# Altium project LM25148.PrjPcb
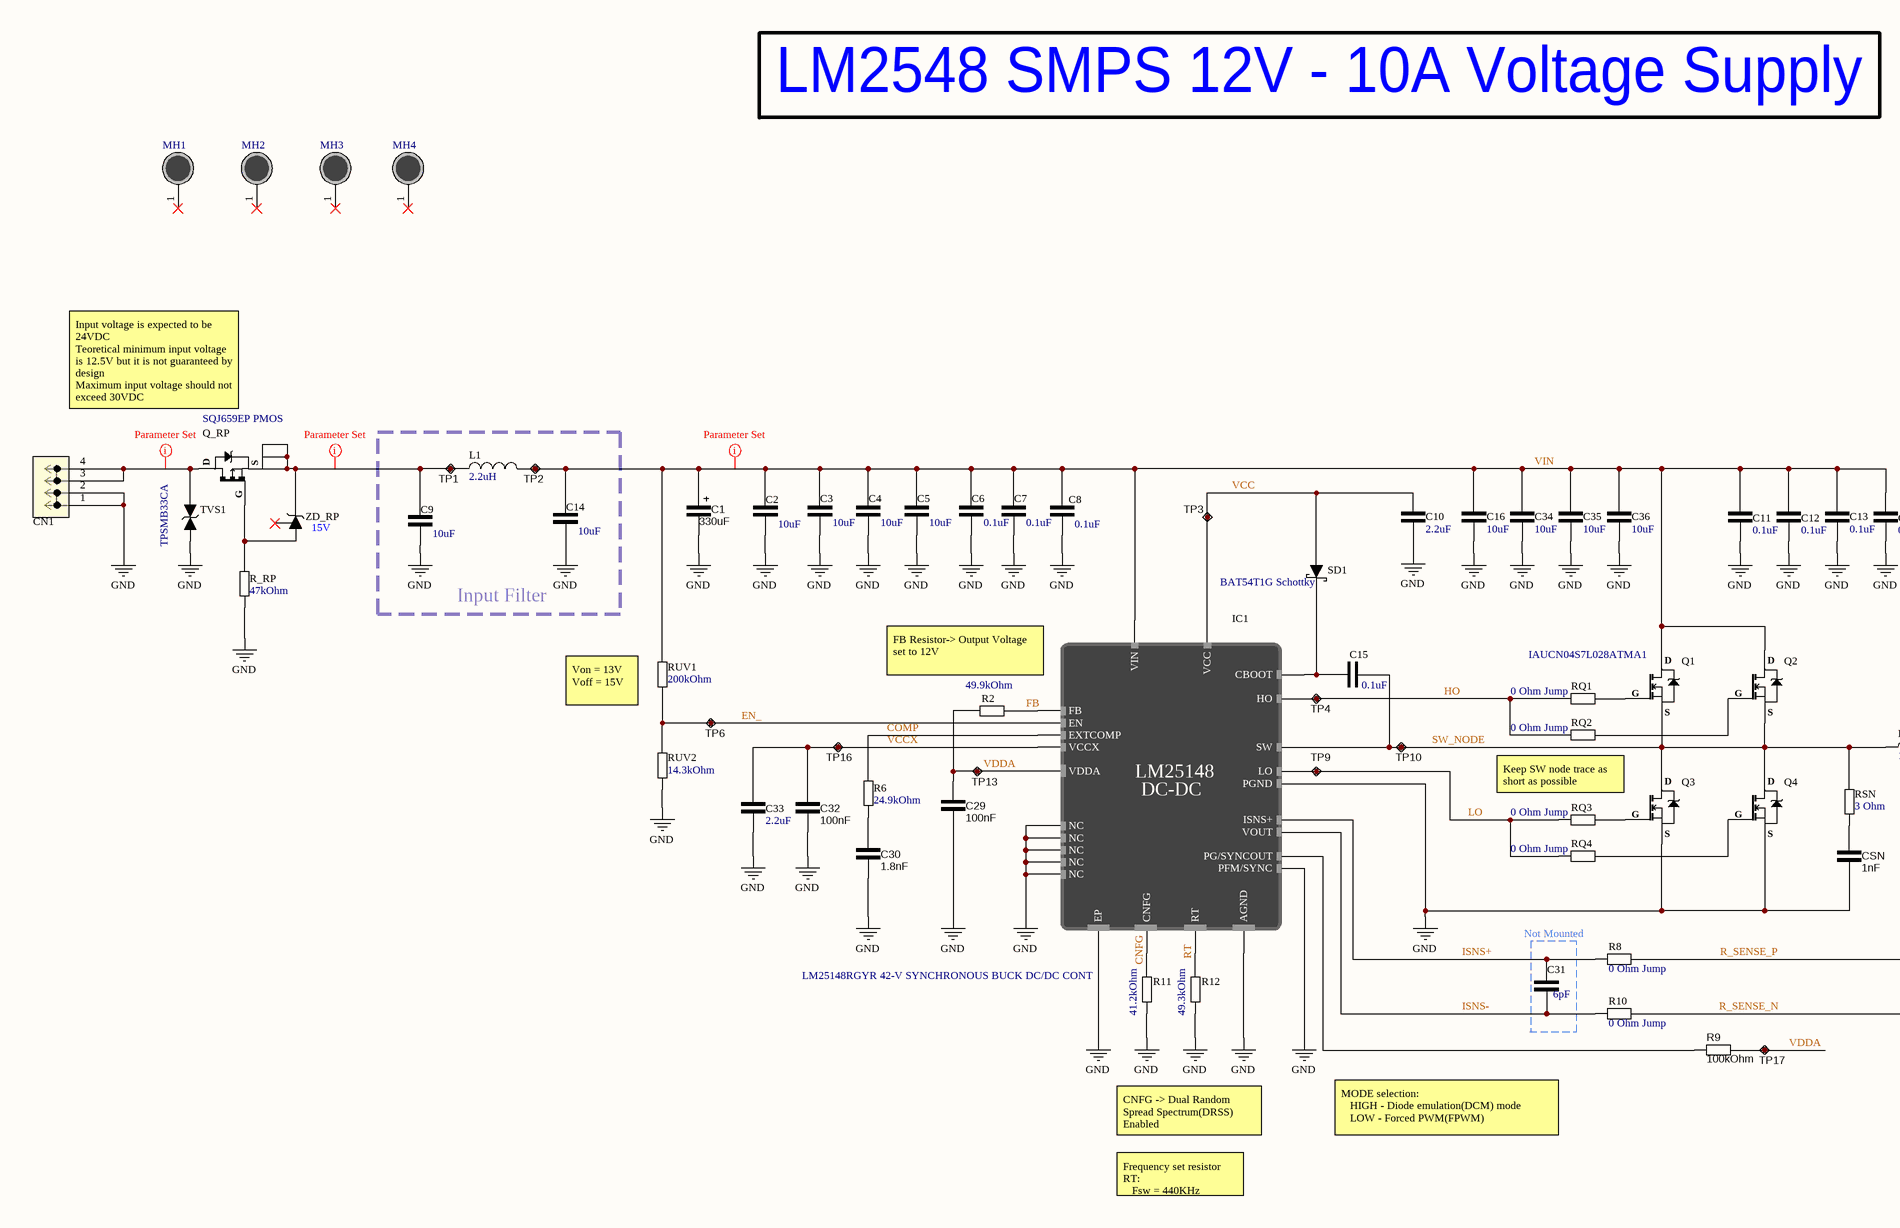
[diagram p0: LM25148_eval_BRD.SchDoc, left]
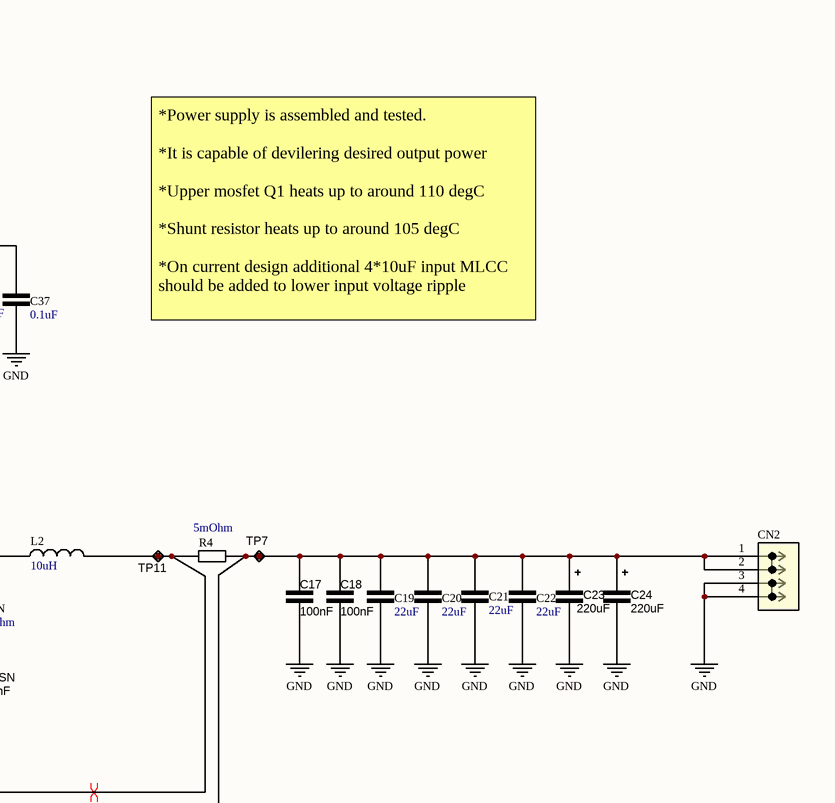
[diagram p1: LM25148_eval_BRD.SchDoc, right]
1 sheet, 79 parts. Net scope: global (net labels, ports and power ports of the same name join across sheets).
Board file: LM25148.PcbDoc

## Sheet LM25148_eval_BRD.SchDoc
size A2; SheetNumber: 1; SheetTotal: 1

### Parts
C1  330uF  [CAPAE109103X103M]
C2  10uF  [CAP_1206]
C3  10uF  [CAP_1206]
C4  10uF  [CAP_1206]
C5  10uF  [CAP_1206]
C6  0.1uF  [CAP_0603]
C7  0.1uF  [CAP_0603]
C8  0.1uF  [CAP_0603]
C9  10uF  [CAP_1206]
C10  2.2uF  [CAP_0603]
C11  0.1uF  [CAP_0603]
C12  0.1uF  [CAP_0603]
C13  0.1uF  [CAP_0603]
C14  10uF  [CAP_1206]
C15  0.1uF  [CAP_0603]
C16  10uF  [CAP_1206]
C17  100nF  [CAP_0603]
C18  100nF  [CAP_0603]
C19  22uF  [CAP_1210]
C20  22uF  [CAP_1210]
C21  22uF  [CAP_1210]
C22  22uF  [CAP_1210]
C23  220uF  [CAPAE109103X103M]
C24  220uF  [CAPAE109103X103M]
C29  100nF  [CAP_0603]
C30  1.8nF  [CAP_0603]
C31  6pF  [CAP_0402]
C32  100nF  [CAP_0603]
C33  2.2uF  [CAP_0603]
C34  10uF  [CAP_1206]
C35  10uF  [CAP_1206]
C36  10uF  [CAP_1206]
C37  0.1uF  [CAP_0603]
CN1  TERM BLK PCB LEVER 3.5MM 2POS  [CONN2_2601-1102_WAG]  (value not drawn)
CN2  TERM BLK PCB LEVER 3.5MM 2POS  [CONN2_2601-1102_WAG]  (value not drawn)
CSN  1nF  [CAP_0805]
IC1  LM25148RGYR 42-V SYNCHRONOUS BUCK DC/DC CONT  [VQFN25_RGY_TEX]
L1  2.2uH  [IHLP-3232DZ-51]
L2  10uH  [INDP135126X65N]
MH1  Mounting Hole  [HOLE-3mm]  (value not drawn)  (no BOM)
MH2  Mounting Hole  [HOLE-3mm]  (value not drawn)  (no BOM)
MH3  Mounting Hole  [HOLE-3mm]  (value not drawn)  (no BOM)
MH4  Mounting Hole  [HOLE-3mm]  (value not drawn)  (no BOM)
Q1  IAUCN04S7L028ATMA1  [PG-TDSON-8-33]
Q2  IAUCN04S7L028ATMA1  [PG-TDSON-8-33]  (value not drawn)
Q3  IAUCN04S7L028ATMA1  [PG-TDSON-8-33]  (value not drawn)
Q4  IAUCN04S7L028ATMA1  [PG-TDSON-8-33]  (value not drawn)
Q_RP  SQJ659EP PMOS  [PowerPAK SO-8L SINGLE]
R2  49.9kOhm  [RES_0603]
R4  5mOhm  [SENSE_RES_2512]
R6  24.9kOhm  [RES_0603]
R8  0 Ohm Jump  [RES_0402]
R9  100kOhm  [RES_0603]
R10  0 Ohm Jump  [RES_0402]
R11  41.2kOhm  [RES_0603]
R12  49.3kOhm  [RES_0603]
R_RP  47kOhm  [RES_0603]
RQ1  0 Ohm Jump  [RES_0402]
RQ2  0 Ohm Jump  [RES_0402]
RQ3  0 Ohm Jump  [RES_0402]
RQ4  0 Ohm Jump  [RES_0402]
RSN  3 Ohm  [RES_0805]
RUV1  200kOhm  [RES_0603]
RUV2  14.3kOhm  [RES_0603]
SD1  BAT54T1G Schottky  [SODFL371X135-2N]
TP1  Test point  [TestPoint]  (value not drawn)  (no BOM)
TP2  Test point  [TestPoint]  (value not drawn)  (no BOM)
TP3  Test point  [TestPoint]  (value not drawn)  (no BOM)
TP4  Test point  [TestPoint]  (value not drawn)  (no BOM)
TP6  Test point  [TestPoint]  (value not drawn)  (no BOM)
TP7  Test point  [TestPoint]  (value not drawn)  (no BOM)
TP9  Test point  [TestPoint]  (value not drawn)  (no BOM)
TP10  Test point  [TestPoint]  (value not drawn)  (no BOM)
TP11  Test point  [TestPoint]  (value not drawn)  (no BOM)
TP13  Test point  [TestPoint]  (value not drawn)  (no BOM)
TP16  Test point  [TestPoint]  (value not drawn)  (no BOM)
TP17  Test point  [TestPoint]  (value not drawn)  (no BOM)
TVS1  TPSMB33CA  [DO-214AA]
ZD_RP  DZ23C15-E3-08 Zener Diode  [SOT95P245X96-3N]  (value not drawn)

### Blocks framed on the sheet
Input Filter: C9 C14 L1 TP1 TP2

### Nets
GND: C1.2 C2.1 C3.2 C4.2 C5.2 C6.2 C7.2 C8.1 C9.1 C10.1 C11.1 C12.1 C13.2 C14.1 C16.2 C17.1 C18.1 C19.2 C20.2 C21.1 C22.2 C23.2 C24.2 C29.1 C30.1 C32.1 C33.2 C34.2 C35.2 C36.2 C37.1 CN1.1(1_1) CN1.2(1_2) CN2.3(2_1) CN2.4(2_2) CSN.1 IC1.1(NC) IC1.2(NC) IC1.7(AGND) IC1.10(PGND) IC1.18(PFM/SYNC) IC1.22(NC) IC1.23(NC) IC1.24(NC) IC1.25(EP) Q3.S(Source) Q4.S(Source) R11.1 R12.1 R_RP.1 RUV2.1 TVS1.2(Anode)
CNFG: IC1.3(CNFG) R11.2
COMP: IC1.5(EXTCOMP) R6.2
EN_: IC1.19(EN) RUV1.1 RUV2.2 TP6.1
FB: IC1.6(FB) R2.2
HO: IC1.13(HO) RQ1.1 RQ2.1 TP4.1
ISNS+: C31.2 IC1.20(ISNS+) R8.1
ISNS-: C31.1 IC1.21(VOUT) R10.1
LO: IC1.11(LO) RQ3.1 RQ4.1 TP9.1
R_SENSE_N: C17.2 C18.2 C19.1 C20.1 C21.2 C22.1 C23.1 C24.1 CN2.1(1_1) CN2.2(1_2) R4.2 R10.2 TP7.1
R_SENSE_P: L2.2 R4.1 R8.2 TP11.1
RT: IC1.4(RT) R12.2
SW_NODE: C15.1 IC1.14(SW) L2.1 Q1.S(Source) Q2.S(Source) Q3.D(Drain) Q4.D(Drain) RSN.2 TP10.1
VCC: C10.2 IC1.9(VCC) SD1.1(Anode) TP3.1
VCCX: C32.2 C33.1 IC1.16(VCCX) TP16.1
VDDA: C29.2 IC1.8(VDDA) R2.1 R9.2 TP13.1 TP17.1
VIN: C1.1 C2.2 C3.1 C4.1 C5.1 C6.1 C7.1 C8.2 C11.2 C12.2 C13.1 C14.2 C16.1 C34.1 C35.1 C36.1 C37.2 IC1.12(VIN) L1.2 Q1.D(Drain) Q2.D(Drain) RUV1.2 TP2.1
NetC9_2: C9.2 L1.1 Q_RP.S(S1) TP1.1 ZD_RP.3(Cathode)
NetC15_2: C15.2 IC1.15(CBOOT) SD1.2(Cathode)
NetC30_2: C30.2 R6.1
NetCN1_3: CN1.3(2_1) CN1.4(2_2) Q_RP.D TVS1.1(Cathode)
NetCSN_2: CSN.2 RSN.1
NetIC1_17: IC1.17(PG/SYNCOUT) R9.1
NetQ1_G: Q1.G(Gate) RQ1.2
NetQ2_G: Q2.G(Gate) RQ2.2
NetQ3_G: Q3.G(Gate) RQ3.2
NetQ4_G: Q4.G(Gate) RQ4.2
NetQ_RP_G: Q_RP.G R_RP.2 ZD_RP.1(Anode)

Not connected (* = marked no-connect by the designer): MH1 1*; MH2 1*; MH3 1*; MH4 1*; ZD_RP 2(Anode)*

### Layout directives
differential pair: R_SENSE_N, R_SENSE_P
rule Clearance Constraint [Clearance = 20mil]: NetC9_2, NetCN1_3
rule Clearance Constraint [Generic clearance = 20mil, and 1 value(s) for objects]: VIN

### Notes on the sheet
- LM2548 SMPS 12V - 10A Voltage Supply
- (near Q_RP) Input voltage is expected to be 24VDC
  Teoretical minimum input voltage is 12.5V but it is not guaranteed by design
  Maximum input voltage should not exceed 30VDC
- (near ZD_RP) 15V
- *Power supply is assembled and tested.
  *It is capable of devilering desired output power
  *Upper mosfet Q1 heats up to around 110 degC
  *Shunt resistor heats up to around 105 degC
  *On current design additional 4*10uF input MLCC should be added to lower input voltage ripple
- (near IC1) FB Resistor-> Output Voltage set to 12V
- (near RUV1) Von = 13V
  Voff = 15V
- Keep SW node trace as short as possible
- Not Mounted
- CNFG -> Dual Random Spread Spectrum(DRSS) Enabled
- MODE selection:
  HIGH - Diode emulation(DCM) mode
  LOW - Forced PWM(FPWM)
- Frequency set resistor RT:
  Fsw = 440KHz
- (in symbol LM25148RGYR) LM25148; DC-DC

### Library data of the parts
C1 = C000026: 330 µF 50 V Aluminum Electrolytic Capacitors Radial, Can - SMD 120mOhm @ 100kHz 2000 Hrs @ 105°C; Manufacturer Product Number: EMZR500ARA331MJA0G; capacitance: 330uF; ComponentLink1Description: DigiKey; ComponentLink1URL: https://www.digikey.com/en/products/detail/chemi-con/EMZR500ARA331MJA0G/5824768; DigiKey Part Number: 565-EMZR500ARA331MJA0GCT-ND
C2-C5 C9 C14 C16 C34-C36 = C000017: 10 µF ±10% 50V Ceramic Capacitor X7R 1206 (3216 Metric); Manufacturer Product Number: CL31B106KBHNNNE; capacitance: 10uF; ComponentLink1Description: DigiKey; ComponentLink1URL: https://www.digikey.com/en/products/detail/samsung-electro-mechanics/CL31B106KBHNNNE/5961251; DigiKey Part Number: 1276-6767-1-ND
C6-C8 C11-C13 C15 C37 = C000018: 0.1 µF ±10% 50V Ceramic Capacitor X7R 0603 (1608 Metric); Manufacturer Product Number: CL10B104KB8NNNC; capacitance: 0.1uF; ComponentLink1Description: DigiKey; ComponentLink1URL: https://www.digikey.com/en/products/detail/samsung-electro-mechanics/CL10B104KB8NNNC/3886658; DigiKey Part Number: 1276-1000-1-ND
C10 C33 = C000014: 8 pF ±0.05pF 25V Ceramic Capacitor C0G, NP0 01005 (0402 Metric); Manufacturer Product Number: GRM188C71C225KE11D; ComponentLink1Description: DigiKey; ComponentLink1URL: https://www.digikey.com/en/products/detail/murata-electronics/GRM188C71C225KE11D/4905311; DigiKey Part Number: 490-12731-1-ND; capacitance: 2.2uF
C17 C18 C29 C32 = C000007: 0.1 µF ±10% 25V Ceramic Capacitor X7R 0603 (1608 Metric); Manufacturer Product Number: KAM15AR71E104KT; ComponentLink1Description: DigiKey; ComponentLink1URL: https://www.digikey.com/en/products/detail/kyocera-avx/06033C104K4T2A/8019250; capacitance: 100nF; DigiKey Part Number: 478-KAM15AR71E104KTCT-ND
C19-C22 = C000032: 22 µF ±10% 25V Ceramic Capacitor X7R 1210 (3225 Metric); Manufacturer Product Number: CL32B226KAJNNNE; DigiKey Part Number: 1276-3392-1-ND; ComponentLink1Description: DigiKey; ComponentLink1URL: https://www.digikey.com/en/products/detail/samsung-electro-mechanics/CL32B226KAJNNNE/3889050; capacitance: 22uF
C23 C24 = C000033: 220 µF 35 V Aluminum - Polymer Capacitors Radial, Can - SMD 23mOhm 1000 Hrs @ 150°C; Manufacturer Product Number: A785MN227M1VLAS023; capacitance: 220uF; ComponentLink1Description: DigiKey; ComponentLink1URL: https://www.digikey.com/en/products/detail/kemet/A785MN227M1VLAS023/22003773?s=N4IgTCBcDaIIIHYAcBWAsgOTGBaCMAagDJwDKADGAMwgC6AvkA; DigiKey Part Number: 399-A785MN227M1VLAS023CT-ND
C30 = C000027: 1800 pF ±10% 25V Ceramic Capacitor X7R 0603 (1608 Metric); Manufacturer Product Number: C0603C182K3RACTU; ComponentLink1Description: DigiKey; ComponentLink1URL: https://www.digikey.com/en/products/detail/kemet/C0603C182K3RAC7867/2200107; DigiKey Part Number: 399-15370-1-ND; capacitance: 1.8nF
C31 = C000016: 6 pF ±0.5pF 25V Ceramic Capacitor C0G, NP0 0402 (1005 Metric); Manufacturer Product Number: CBR04C609D3GAC; DigiKey Part Number: 399-CBR04C609D3GACCT-ND; ComponentLink1Description: DigiKey; ComponentLink1URL: https://www.digikey.com/en/products/detail/kemet/CBR04C609D3GAC/18137865?s=N4IgjCBcpgLFoDGUBmBDANgZwKYBoQB7KAbXAFYBOAJlgHYQBdAgBwBcoQBlNgJwEsAdgHMQAXwJgAbAhDJI6bPiKkQAZkphyADiasOkbnyGiJIagAZYlWfMW4CxSGSkACFgDE9IdpwCqgvxsAPIoALI4aFgArrw44gQAtNS2UHzRyk5k5ExieUA; capacitance: 6pF
CN1 CN2 = 00000017: 2 Position Wire to Board Terminal Block Horizontal with Board 0.138" (3.50mm) Through Hole; Manufacturer Product Number: 2601-1102; Digikey Part Number: 2946-2601-1102-ND; ComponentLink1Description: Digikey; ComponentLink1URL: https://www.digikey.com/en/products/detail/wago-corporation/2601-1102/17122694
CSN = C000035: 1000 pF ±10% 100V Ceramic Capacitor X7R 0805 (2012 Metric); Manufacturer Product Number: CC0805KRX7R0BB102; capacitance: 1nF; ComponentLink1Description: DigiKey; ComponentLink1URL: https://www.digikey.com/en/products/detail/yageo/CC0805KRX7R0BB102/2833637; DigiKey Part Number: 311-1472-1-ND
IC1 = LM25148RGYR: Buck Regulator Positive Output Step-Down DC-DC Controller IC 24-VQFN (5.5x3.5); DigiKey Part Number: 296-LM25148RGYRCT-ND; Mouser Part Number: 595-LM25148RGYR; ComponentLink1Description: DigiKey; ComponentLink1URL: https://www.digikey.com/en/products/detail/texas-instruments/LM25148RGYR/15857124; ComponentLink2Description: Mouser; ComponentLink2URL: https://eu.mouser.com/ProductDetail/Texas-Instruments/LM25148RGYR?qs=doiCPypUmgEViljGB5jAZw%3D%3D; Manufacturer Product Number: LM25148RGYR
L1 = L000015: FIXED IND 2.2UH 11.5A 12.5 MOHM; Manufacturer Product Number: IHLP3232DZER2R2M5A; inductance: 2.2uH; DigiKey Part Number: 541-IHLP3232DZER2R2M5ACT-ND; ComponentLink1Description: DigiKey; ComponentLink1URL: https://www.digikey.com/en/products/detail/vishay-dale/IHLP3232DZER2R2M5A/4070222; case: 3232; Mouser Part Number: 70-IHLP3232DZR2R2M5A; ComponentLink2Description: Mouser; ComponentLink2URL: https://eu.mouser.com/ProductDetail/Vishay-Dale/IHLP3232DZER2R2M5A?qs=tDDpbAIEejr3%252BeiaEh99%252Bg%3D%3D
L2 = L000016: FIXED IND 10UH 11A 15.8 MOHM SMD; Manufacturer Product Number: PA4343.103ANLT; inductance: 10uH; DigiKey Part Number: 553-4029-1-ND; ComponentLink1Description: DigiKey; ComponentLink1URL: https://www.digikey.com/en/products/detail/pulse-electronics/PA4343-103ANLT/7943151?s=N4IgTCBcDaIAoEEAsBmVA6AjABhQgcgDIAqIAugL5A; case: 13.5x12.6; Mouser Part Number: 673-PA4343.103ANLT; ComponentLink2Description: Mouser; ComponentLink2URL: https://eu.mouser.com/ProductDetail/Pulse-Electronics/PA4343.103ANLT?qs=chTDxNqvsym%252BWuIQdh7qfw%3D%3D
MH1-MH4 = 00000006: Mounting Hole 3mm
Q1-Q4 = 00000014: N-Channel 40 V 100A Surface Mount PG-TDSON-8-33; DigiKey Part Number: 448-IAUCN04S7L028ATMA1CT-ND; Mouser Part Number: 726-IAUCN04S7L028ATM; ComponentLink1Description: DigiKey; ComponentLink1URL: https://www.digikey.com/en/products/detail/infineon-technologies/IAUCN04S7L028ATMA1/22157720?s=N4IgTCBcDaIJIEECqBhAcgBgCwGUDsAMhmABwgC6AvkA; ComponentLink2Description: Mouser; ComponentLink2URL: https://eu.mouser.com/ProductDetail/Infineon-Technologies/IAUCN04S7L028ATMA1?qs=mELouGlnn3deeHozE86VbA%3D%3D; ComponentLink3Description: Footprint Drawing; ComponentLink3URL: https://www.infineon.com/cms/en/product/packages/PG-TDSON/PG-TDSON-8-33/; Manufacturer Product Number: IAUCN04S7L028ATMA1
Q_RP = 00000005: P-Channel 60 V 52A (Tc) 83W (Tc) Surface Mount PowerPAK® SO-8; Manufacturer Product Number: SQJ459EP-T1_GE3; DigiKey Part Number: SQJ459EP-T1_GE3CT-ND; Mouser Part Number: 78-SQJ459EP-T2_BE3; ComponentLink1Description: DigiKey; ComponentLink1URL: https://www.digikey.com/en/products/detail/vishay-siliconix/SQJ459EP-T1-GE3/6708881; ComponentLink2Description: Mouser; ComponentLink2URL: https://eu.mouser.com/ProductDetail/Vishay-Siliconix/SQJ459EP-T2_BE3?qs=CiayqK2gdcKpg8h0vLRPjA%3D%3D
R2 = R000025: 49.9 kOhms ±1% 0.1W, 1/10W Chip Resistor 0603 (1608 Metric) Moisture Resistant Thick Film; Manufacturer Product Number: CRCW060349K9FKEA; ComponentLink1Description: DigiKey; ComponentLink1URL: https://www.digikey.com/en/products/detail/vishay-dale/CRCW060349K9FKEA/1180003; resistance: 49.9kOhm; DigiKey Part Number: 541-49.9KHCT-ND
R4 = R000033: 5 mOhms ±1% 2W Chip Resistor 2512 (6332 Metric) Automotive AEC-Q200, Current Sense, Moisture Resistant Metal Element; Manufacturer Product Number: CRF2512-FZ-R005ELF; ComponentLink1Description: DigiKey; ComponentLink1URL: https://www.digikey.com/en/products/detail/bourns-inc/CRF2512-FZ-R005ELF/6210986; resistance: 5mOhm; DigiKey Part Number: CRF2512-FZ-R005ELFCT-ND
R6 = R000017: 24.9 kOhms ±1% 0.1W, 1/10W Chip Resistor 0603 (1608 Metric) Automotive AEC-Q200 Thick Film; Manufacturer Product Number: ERJ-3EKF2492V; ComponentLink1Description: DigiKey; ComponentLink1URL: https://www.digikey.com/en/products/detail/panasonic-electronic-components/ERJ-3EKF2492V/196236; resistance: 24.9kOhm; DigiKey Part Number: P24.9KHCT-ND
R8 R10 RQ1-RQ4 = R000008: 0 Ohms Jumper Chip Resistor 0402 (1005 Metric) Automotive AEC-Q200 Thick Film; Manufacturer Product Number: ERJ-2GE0R00X; resistance: 0 Ohm Jump; DigiKey Part Number: P0.0JCT-ND; ComponentLink1Description: DigiKey; ComponentLink1URL: https://www.digikey.com/en/products/detail/panasonic-electronic-components/ERJ-2GE0R00X/146727
R9 = R000006: 100 kOhms ±1% 0.1W, 1/10W Chip Resistor 0603 (1608 Metric) Automotive AEC-Q200 Thick Film; Manufacturer Product Number: RMCF0603FG100K; resistance: 100kOhm; ComponentLink1Description: DigiKey; ComponentLink1URL: https://www.digikey.com/en/products/detail/stackpole-electronics-inc/RMCF0603FG100K/1713543; DigiKey Part Number: RMCF0603FG100KCT-ND
R11 = R000015: 41.2 kOhms ±1% 0.1W, 1/10W Chip Resistor 0603 (1608 Metric) Automotive AEC-Q200 Thick Film; Manufacturer Product Number: ERJ-3EKF4122V; ComponentLink1Description: DigiKey; ComponentLink1URL: https://www.digikey.com/en/products/detail/panasonic-electronic-components/ERJ-3EKF4122V/196347; resistance: 41.2kOhm; DigiKey Part Number: P41.2KHCT-ND
R12 = R000023: 49.3 kOhms ±0.1% 0.1W, 1/10W Chip Resistor 0603 (1608 Metric) Thin Film; Manufacturer Product Number: RT0603BRD0749K3L; ComponentLink1Description: DigiKey; ComponentLink1URL: https://www.digikey.com/en/products/detail/yageo/RT0603BRD0749K3L/5927964; resistance: 49.3kOhm; DigiKey Part Number: 13-RT0603BRD0749K3LCT-ND
R_RP = R000010: 47 kOhms ±1% 0.1W, 1/10W Chip Resistor 0603 (1608 Metric) Moisture Resistant Thick Film; Manufacturer Product Number: RC0603FR-0747KL; ComponentLink1Description: DigiKey; ComponentLink1URL: https://www.digikey.com/en/products/detail/yageo/RC0603FR-0747KL/727253; resistance: 47kOhm; DigiKey Part Number: 311-47.0KHRCT-ND
RSN = R000034: 3 Ohms ±1% 0.125W, 1/8W Chip Resistor 0805 (2012 Metric) Moisture Resistant Thick Film; Manufacturer Product Number: RC0805FR-073RL; ComponentLink1Description: DigiKey; ComponentLink1URL: https://www.digikey.com/en/products/detail/yageo/RC0805FR-073RL/727799; resistance: 3 Ohm; DigiKey Part Number: 311-3.00CRCT-ND
RUV1 = R000031: 200 kOhms ±1% 0.1W, 1/10W Chip Resistor 0603 (1608 Metric) Moisture Resistant Thick Film; Manufacturer Product Number: RC0603FR-07200KL; ComponentLink1Description: DigiKey; ComponentLink1URL: https://www.digikey.com/en/products/detail/yageo/RC0603FR-07200KL/727044; resistance: 200kOhm; DigiKey Part Number: 311-200KHRCT-ND
RUV2 = R000032: 14.3 kOhms ±1% 0.1W, 1/10W Chip Resistor 0603 (1608 Metric) Automotive AEC-Q200 Thick Film; Manufacturer Product Number: RMCF0603FT14K3; ComponentLink1Description: DigiKey; ComponentLink1URL: https://www.digikey.com/en/products/detail/stackpole-electronics-inc/RMCF0603FT14K3/1761296; resistance: 14.3kOhm; DigiKey Part Number: RMCF0603FT14K3CT-ND
SD1 = 00000009: Diode 30 V 200mA Surface Mount SOD-123; DigiKey Part Number: BAT54T1GOSCT-ND; ComponentLink1Description: DigiKey; ComponentLink1URL: https://www.digikey.com/en/products/detail/onsemi/BAT54T1G/918319; Manufacturer Product Number: BAT54T1G
TP1-TP4 TP6 TP7 TP9-TP11 TP13 TP16 TP17 = TP002: Test point 1mm
TVS1 = 00000015: 45.7V Clamp 13.3A Ipp Tvs Diode Surface Mount DO-214AA (SMBJ); DigiKey Part Number: F6323CT-ND; ComponentLink1Description: DigiKey; ComponentLink1URL: https://www.digikey.com/en/products/detail/littelfuse-inc/TPSMB33CA/4835275; Manufacturer Product Number: TPSMB33CA
ZD_RP = 00000006: Zener Diode Array 1 Pair Common Cathode 15 V 300 mW ±5% SOT-23-3; DigiKey Part Number: 112-DZ23C15-E3-08CT-ND; ComponentLink1Description: DigiKey; ComponentLink1URL: https://www.digikey.com/en/products/detail/vishay-general-semiconductor-diodes-division/DZ23C15-E3-08/4831460; Manufacturer Product Number: DZ23C15-E3-08

## Assembly variants
Only Populated Components: not fitted C31